# Altium project Caven_Pro.PrjPcb
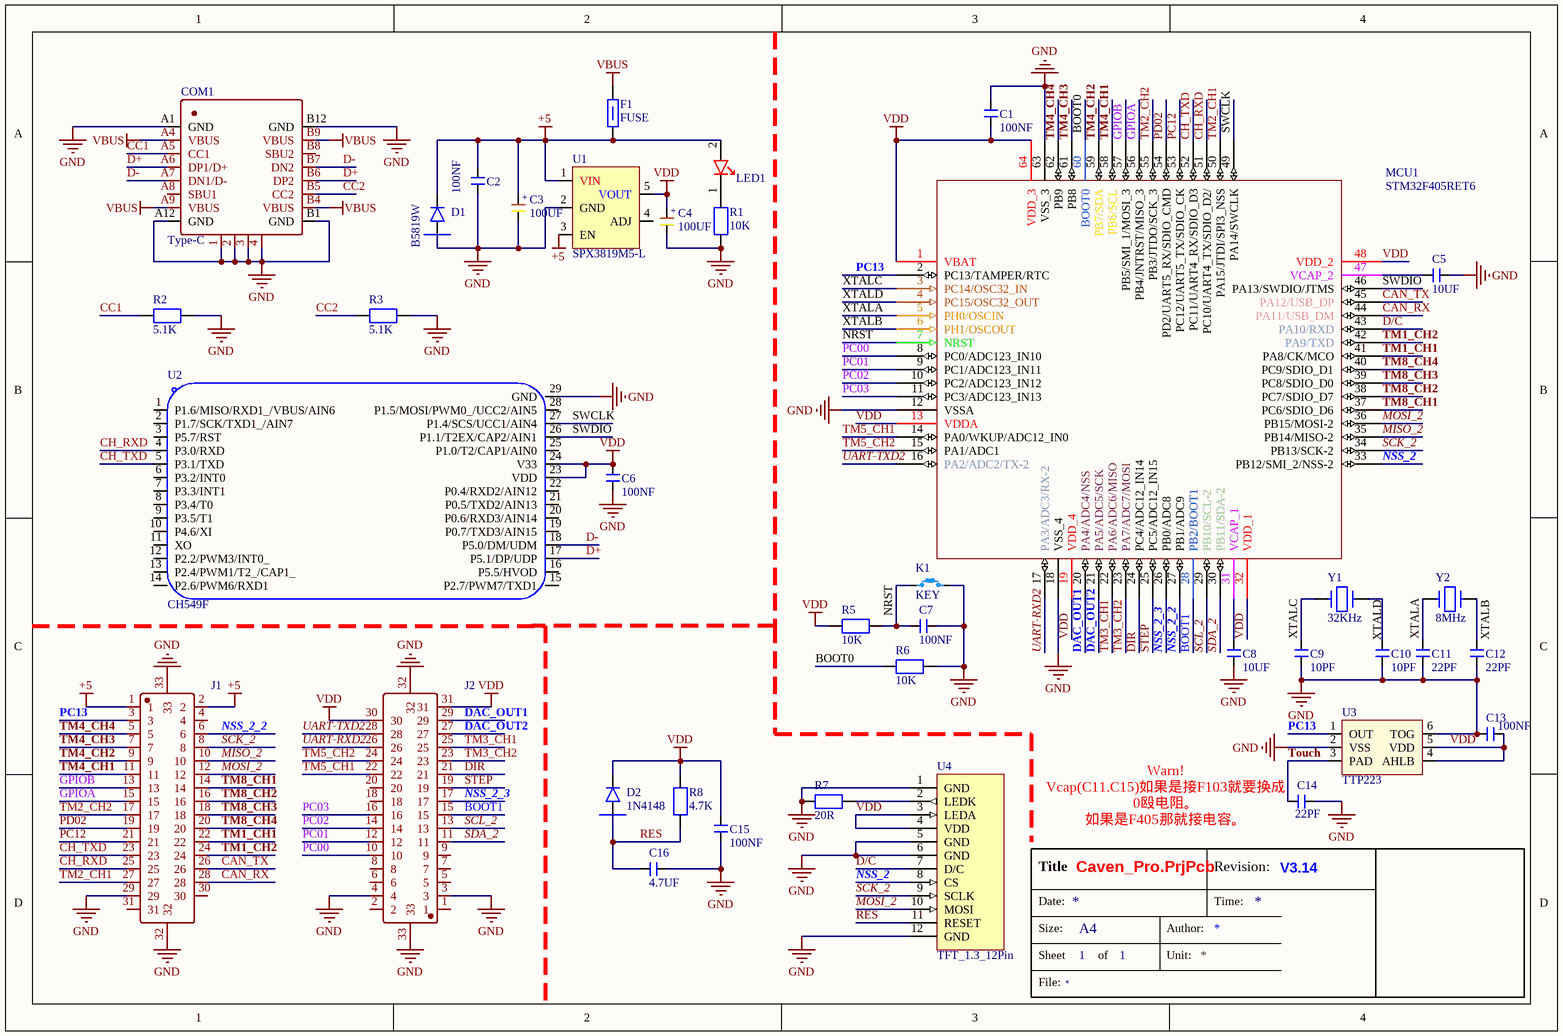
[diagram p0: Sheet.SchDoc]
1 sheet, 38 parts. Net scope: global (net labels, ports and power ports of the same name join across sheets).
Board file: Copy of PCB1.PcbDoc

## Sheet Sheet.SchDoc
size A4; Revision: V3.14; SheetNumber: 1; SheetTotal: 1

### Parts
C1  100NF  [CAP_0603]
C2  100NF  [CAP_0603]
C3  100UF  [CAP_3216_A]
C4  100UF  [CAP_3216_A]
C5  10UF  [CAP_0603]
C6  100NF  [CAP_0603]
C7  100NF  [CAP_0603]
C8  10UF  [CAP_0603]
C9  10PF  [CAP_0603]
C10  10PF  [CAP_0603]
C11  22PF  [CAP_0603]
C12  22PF  [CAP_0603]
C13  100NF  [CAP_0603]
C14  22PF  [CAP_0603]
C15  100NF  [CAP_0603]
C16  4.7UF  [CAP_0603]
COM1  Type-C  [USB-Type-C_16A]
D1  B5819W  [DIODE_SOD123]
D2  1N4148  [DIODE_SOD123]
F1  FUSE  [Fuse_0603]
J1  31PIN  [BTB-DM3-31P]  (value not drawn)
J2  31PIN  [BTB-DM3-31P]  (value not drawn)
K1  KEY  [KEY_SMD]
LED1  LED_R/G/B/Y  [LED_0603_R]  (value not drawn)
MCU1  STM32F405RET6  [LQFP_64_10X10]
R1  10K  [RESC_0603_2]
R2  5.1K  [RESC_0603_2]
R3  5.1K  [RESC_0603_2]
R5  10K  [RESC_0603_2]
R6  10K  [RESC_0603_2]
R7  20R  [RESC_0603_2]
R8  4.7K  [RESC_0603_2]
U1  SPX3819M5-L  [SOT23_5]
U2  CH549F  [QFN28_4X4_L]
U3  TTP223  [SOT-23-6]
U4  TFT_1.3_12Pin  [LCD_1.3B]
Y1  32KHz  [XTAL_SMD_3215]
Y2  8MHz  [XTAL-SMD5032-2P]

### Nets
+5: C2.2 C3.1 D1.2(N) F1.1 J1.1 J1.2 LED1.2(+) U1.1(VIN) U1.3(EN)
GND: C1.1 C2.1 C3.2 C4.2 C5.1 C6.1 C7.1 C8.1 C9.2 C10.2 C11.2 C12.2 C13.1 C14.2 C15.2 C16.2 COM1.1 COM1.2 COM1.3 COM1.4 COM1.A1(GND) COM1.A12(GND) COM1.B1(GND) COM1.B12(GND) D1.1(P) J1.29 J1.32 J1.33 J2.3 J2.4 J2.32 J2.33 K1.1 MCU1.12(VSSA) MCU1.18(VSS_4) MCU1.63(VSS_3) R1.1 R2.1 R3.1 R6.2 R7.1 U1.2(GND) U2.29(GND) U3.2(VSS) U3.6(TOG) U4.1(GND) U4.5(GND) U4.6(GND) U4.12(GND)
VBUS: COM1.A4(VBUS) COM1.A9(VBUS) COM1.B4(VBUS) COM1.B9(VBUS) F1.2
VDD: C1.2 C4.1 C6.2 C13.2 C15.1 D2.2(N) J2.30 J2.31 MCU1.1(VBAT) MCU1.13(VDDA) MCU1.19(VDD_4) MCU1.32(VDD_1) MCU1.48(VDD_2) MCU1.64(VDD_3) R5.1 R8.1 U1.5(VOUT) U2.23(VDD) U2.24(V33) U3.4(AHLB) U3.5(VDD) U4.3(LEDA) U4.4(VDD)
BOOT0: MCU1.60(BOOT0) R6.1
BOOT1: J2.15 MCU1.28(PB2/BOOT1)
CAN_RX: J1.28 MCU1.44(PA11/USB_DM)
CAN_TX: J1.26 MCU1.45(PA12/USB_DP)
CC1: COM1.A5(CC1) R2.2
CC2: COM1.B5(CC2) R3.2
CH_RXD: J1.25 MCU1.51(PC10/UART4_TX/SDIO_D2/) U2.4(P3.0/RXD)
CH_TXD: J1.23 MCU1.52(PC11/UART4_RX/SDIO_D3) U2.5(P3.1/TXD)
D+: COM1.A6(DP1/D+) COM1.B6(DP2) U2.17(P5.1/DP/UDP)
D-: COM1.A7(DN1/D-) COM1.B7(DN2) U2.18(P5.0/DM/UDM)
D/C: MCU1.43(PA10/RXD) U4.7(D/C)
DAC_OUT1: J2.29 MCU1.20(PA4/ADC4/NSS)
DAC_OUT2: J2.27 MCU1.21(PA5/ADC5/SCK)
DIR: J2.21 MCU1.24(PC4/ADC12_IN14)
GPIOA: J1.15 MCU1.56(PB4/JNTRST/MISO_3)
GPIOB: J1.13 MCU1.57(PB5/SMI_1/MOSI_3)
MISO_2: J1.10 MCU1.35(PB14/MISO-2)
MOSI_2: J1.12 MCU1.36(PB15/MOSI-2) U4.10(MOSI)
NRST: C7.2 K1.2 MCU1.7(NRST) R5.2
NSS_2: MCU1.33(PB12/SMI_2/NSS-2) U4.8(CS)
NSS_2_2: J1.6 MCU1.27(PB1/ADC9)
NSS_2_3: J2.17 MCU1.26(PB0/ADC8)
PC00: J2.10 MCU1.8(PC0/ADC123_IN10)
PC01: J2.12 MCU1.9(PC1/ADC123_IN11)
PC02: J2.14 MCU1.10(PC2/ADC123_IN12)
PC03: J2.16 MCU1.11(PC3/ADC123_IN13)
PC12: J1.21 MCU1.53(PC12/UART5_TX/SDIO_CK)
PC13: J1.3 MCU1.2(PC13/TAMPER/RTC) U3.1(OUT)
PD02: J1.19 MCU1.54(PD2/UART5_RX/SDIO_CMD)
RES: C16.1 D2.1(P) R8.2 U4.11(RESET)
SCK_2: J1.8 MCU1.34(PB13/SCK-2) U4.9(SCLK)
SCL_2: J2.13 MCU1.29(PB10/SCL-2)
SDA_2: J2.11 MCU1.30(PB11/SDA-2)
STEP: J2.19 MCU1.25(PC5/ADC12_IN15)
SWCLK: MCU1.49(PA14/SWCLK) U2.27(P1.4/SCS/UCC1/AIN4)
SWDIO: MCU1.46(PA13/SWDIO/JTMS) U2.26(P1.1/T2EX/CAP2/AIN1)
TM1_CH1: J1.22 MCU1.41(PA8/CK/MCO)
TM1_CH2: J1.24 MCU1.42(PA9/TXD)
TM2_CH1: J1.27 MCU1.50(PA15/JTDI/SPI3_NSS)
TM2_CH2: J1.17 MCU1.55(PB3/JTDO/SCK_3)
TM3_CH1: J2.25 MCU1.22(PA6/ADC6/MISO)
TM3_CH2: J2.23 MCU1.23(PA7/ADC7/MOSI)
TM4_CH1: J1.11 MCU1.58(PB6/SCL)
TM4_CH2: J1.9 MCU1.59(PB7/SDA)
TM4_CH3: J1.7 MCU1.61(PB8)
TM4_CH4: J1.5 MCU1.62(PB9)
TM5_CH1: J2.22 MCU1.14(PA0/WKUP/ADC12_IN0)
TM5_CH2: J2.24 MCU1.15(PA1/ADC1)
TM8_CH1: J1.14 MCU1.37(PC6/SDIO_D6)
TM8_CH2: J1.16 MCU1.38(PC7/SDIO_D7)
TM8_CH3: J1.18 MCU1.39(PC8/SDIO_D0)
TM8_CH4: J1.20 MCU1.40(PC9/SDIO_D1)
Touch: C14.1 U3.3(PAD)
UART-RXD2: J2.26 MCU1.17(PA3/ADC3/RX-2)
UART-TXD2: J2.28 MCU1.16(PA2/ADC2/TX-2)
XTALA: C11.1 MCU1.5(PH0/OSCIN) Y2.2
XTALB: C12.1 MCU1.6(PH1/OSCOUT) Y2.1
XTALC: C9.1 MCU1.3(PC14/OSC32_IN) Y1.2
XTALD: C10.1 MCU1.4(PC15/OSC32_OUT) Y1.1
NetC5_2: C5.2 MCU1.47(VCAP_2)
NetC8_2: C8.2 MCU1.31(VCAP_1)
NetLED1_1: LED1.1(-) R1.2
NetR7_2: R7.2 U4.2(LEDK)

Not connected (* = marked no-connect by the designer): COM1 A8(SBU1) B8(SBU2); J1 4 30 31; J2 1 2 5 6 7 8 9 18 20; U1 4(ADJ); U2 1(P1.6/MISO/RXD1_/VBUS/AIN6) 2(P1.7/SCK/TXD1_/AIN7) 3(P5.7/RST) 6(P3.2/INT0) 7(P3.3/INT1) 8(P3.4/T0) 9(P3.5/T1) 10(P4.6/XI) 11(XO) 12(P2.2/PWM3/INT0_) 13(P2.4/PWM1/T2_/CAP1_) 14(P2.6/PWM6/RXD1) 15(P2.7/PWM7/TXD1) 16(P5.5/HVOD) 19(P0.7/TXD3/AIN15) 20(P0.6/RXD3/AIN14) 21(P0.5/TXD2/AIN13) 22(P0.4/RXD2/AIN12) 25(P1.0/T2/CAP1/AIN0) 28(P1.5/MOSI/PWM0_/UCC2/AIN5)

### Notes on the sheet
- (near C14) Warn!
  Vcap(C11.C15)如果是接F103就要换成0殴电阻。
  如果是F405那就接电容。
- Title
- Date:
- Revision:
- Time:
- File:
- Size:
- Sheet
- A4
- of
- Author:
- Unit:
- (in symbol CAP_TA) +

### Library data of the parts
C1 C2 C5-C16 = CAP: CAP  12~50V
C3 C4 = CAP_TA: CAP  6~12V  钽电容
COM1 = USB-type_c: USB
D1 D2 = Diode-SM: Diode_肖特基/二极管
J1 J2 = BTB_DF3_31Pin: BTB
LED1 = LED_SMT: LED
MCU1 = STM32f4_R: MCU
R1 R5-R8 = RES_S: RES 贴片
R2 R3 = RES: RES 贴片
U1 = SPX3819M5-L: DC-DC   3.3V  500ma
U2 = CH549F: MCU; Manufacturer: WCH(南京沁恒); Add into BOM: yes; CPU Core: 51系列; Maximum Frequency: 48MHz; Supply Voltage Range: 3.3V~5V; Internal Oscillator: 有; External Clock Frequency Rang: 6MHz~25MHz; Program FLASH Size: 64KB; RAM Size: 2.25KB; EEPROM/Data FLASH Size: 1KB; ADC (Units/Channels/bits): 1@x16ch/12bit; (E)PWM (Units/Channels/bits): 1@x8ch/8bit; 16Bit Timer Number: 3; U(S)ART Number: 4; (Q)SPI Number: 1; USB (H/D/OTG): 全速USB Host/Device; Peripherals / Functions / Protocol Stacks: 低电压检测；看门狗；CCP捕获/比较；触控按键；片载温度传感器；CRC校验；DMA; Symbol: CH549F; Device: CH549F; LCSC Part Name: CH549F; Supplier Part: C367229; Manufacturer Part: CH549F; Supplier Footprint: QFN-28; JLCPCB Part Class: Extended Part; Datasheet: https://atta.szlcsc.com/upload/public/pdf/source/20200819/C367229_D216FC0E0489DFB21C5778C34F7DC8A5.pdf; Supplier: LCSC; Convert to PCB: yes; GPIO Ports Number: -; DAC (Units/Channels/bits): -; 8Bit Timer Number: -; 32Bit Timer Number: -; CMP Number: -; I2C Number: -; I2S Number: -; CAN Number: -; Operating Temperature Range: -40~+70
U3 = TTP223: 触摸芯片
U4 = LCD_1.3   T: ST7789V-SPI
Y1 Y2 = XTAL: CRYSTAL